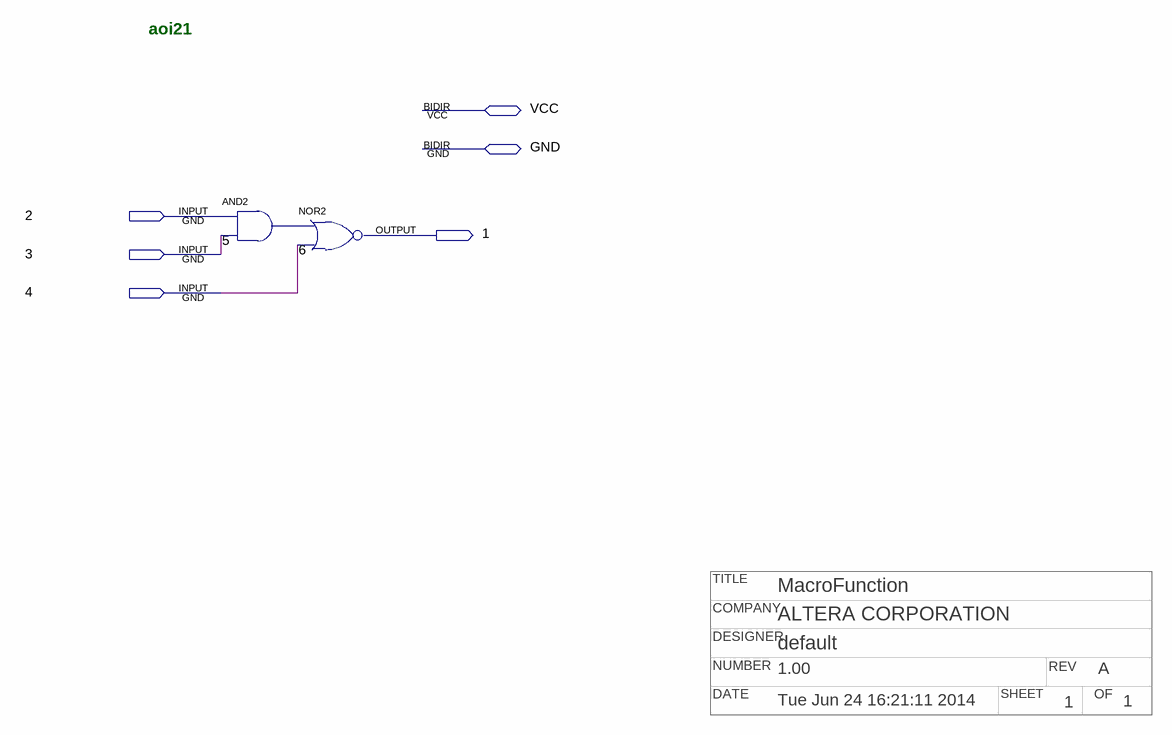
[diagram p0: schematic sheet]
// Quartus schematic npaoi21.bdf as structural Verilog: 2 symbols, 6 pins
// Title block: TITLE: MacroFunction; COMPANY: ALTERA CORPORATION; DESIGNER: default; NUMBER: 1.00; REV: A; DATE: Tue Jun 24 16:21:11 2014; SHEET: 1; OF: 1
module npaoi21 (
  input  \2 ,
  input  \3 ,
  input  \4 ,
  inout  VCC,
  inout  GND,
  output \1 
);

  wire n5_out;

  and u_5 (n5_out, \2 , \3 );
  nor u_6 (\1 , n5_out, \4 );

  // Notes on the sheet:
  //   aoi21
endmodule
